# EAGLE schematic rs485 (EAGLE 9.6.2)
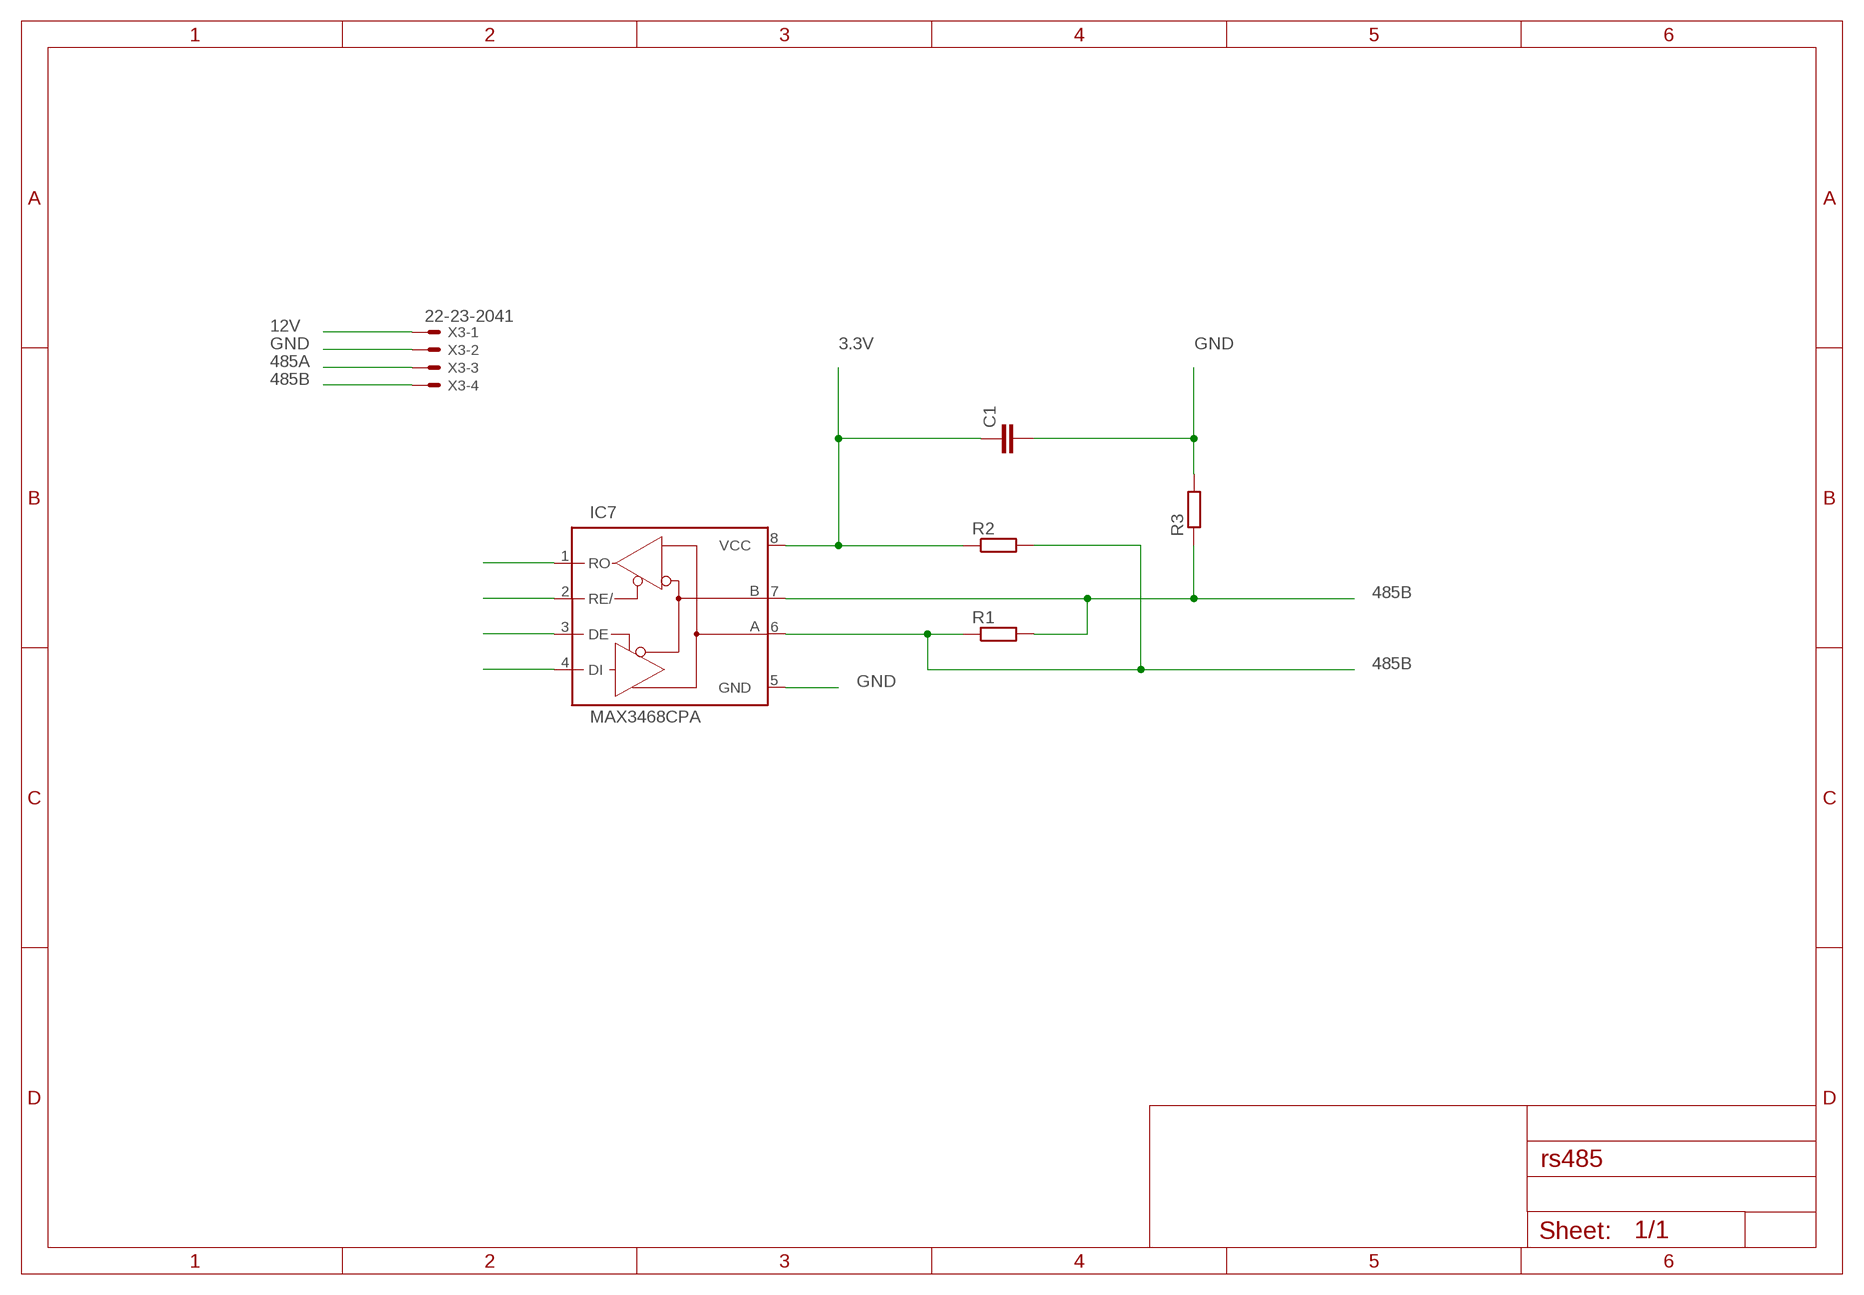
[diagram p0: schematic, sheet 1]

## Parts
C1  C-EU025-024X044  [C025-024X044]
IC7  MAX3468CPA  [DIL08]
R1  R-EU_0207/10  [0207/10]
R2  R-EU_0207/10  [0207/10]
R3  R-EU_0207/10  [0207/10]
X3  22-23-2041  [22-23-2041]

## Nets
3.3V: C1.1 IC7.8(VCC) R2.1
12V: X3.1
485A: X3.3
485B: IC7.6(A) IC7.7(B) R1.1 R1.2 R2.2 R3.1 X3.4
GND: C1.2 IC7.5(GND) R3.2 X3.2
N$5: IC7.1(RO)
N$6: IC7.2(RE/)
N$7: IC7.3(DE)
N$8: IC7.4(DI)

## Library data of the parts
C1 = rcl:C-EU: CAPACITOR, European symbol; SPICEPREFIX: C
IC7 = maxim:MAX34*: +5V, Fail-Safe, 40Mbps, Profibus RS-485/RS-422 Transceivers Source: MAX3465-MAX3469.pdf; OC_FARNELL: unknown; OC_NEWARK: unknown
R1-R3 = rcl:R-EU_: RESISTOR, European symbol; SPICEPREFIX: R
X3 = con-molex:22-23-2041: .100" (2.54mm) Center Header - 4 Pin; MF: MOLEX; MPN: 22-23-2041; OC_FARNELL: 1462920; OC_NEWARK: 38C0355